# EAGLE schematic BubbleDisplayTempSensingThermistorNoSignalConditioning (EAGLE 7.6.0)
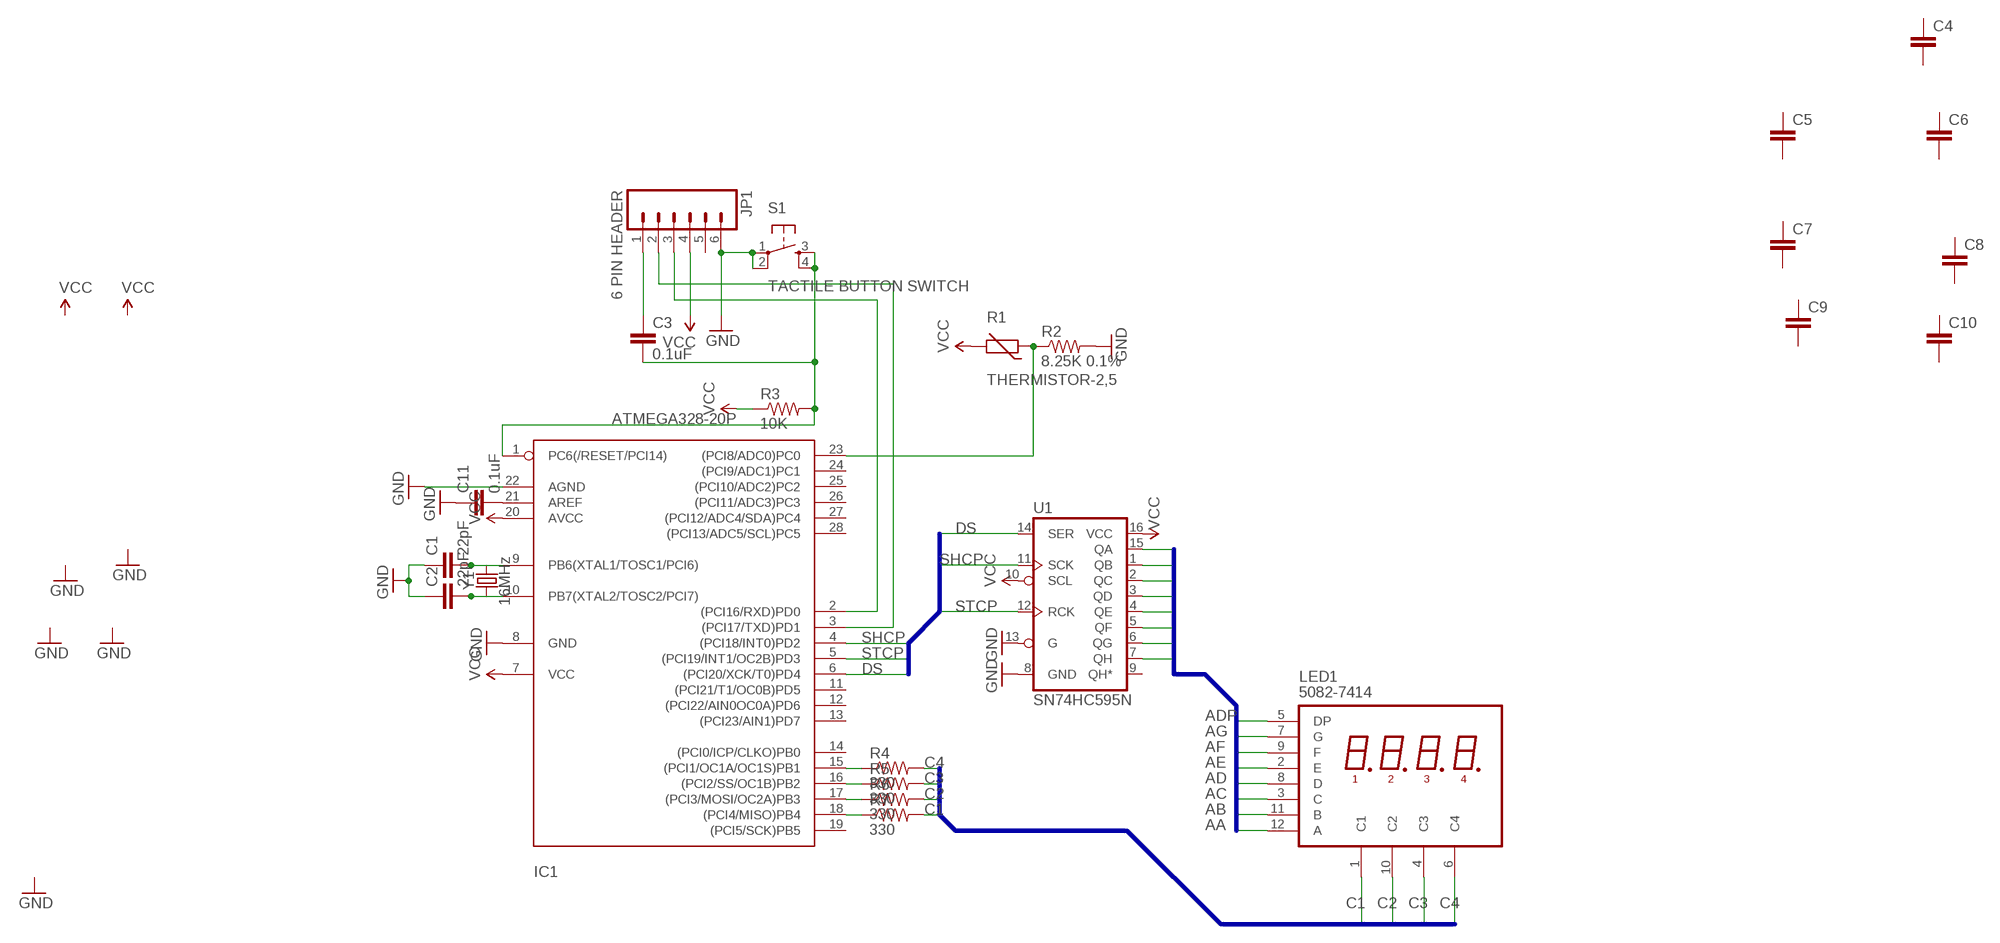
[diagram p0: schematic, sheet 1]

## Parts
C1  22pF  CAPKIT  [CAP-PTH-SMALL-KIT]
C2  22pF  CAPKIT  [CAP-PTH-SMALL-KIT]
C3  0.1uF  CAPEZ  [CAP-PTH-SMALLEZ]
C4  CAPEZ  [CAP-PTH-SMALLEZ]
C5  CAPEZ  [CAP-PTH-SMALLEZ]
C6  CAPEZ  [CAP-PTH-SMALLEZ]
C7  CAPEZ  [CAP-PTH-SMALLEZ]
C8  CAPEZ  [CAP-PTH-SMALLEZ]
C9  CAPEZ  [CAP-PTH-SMALLEZ]
C10  CAPEZ  [CAP-PTH-SMALLEZ]
C11  0.1uF  CAPEZ  [CAP-PTH-SMALLEZ]
IC1  ATMEGA328-20P  [DIL28-3]
JP1  6 PIN HEADER  M06LOCK_LONGPADS  [1X06_LOCK_LONGPADS]
LED1  5082-7414  [5082-7414]
R1  THERMISTOR-2,5  [RS-2,5]
R2  8.25K 0.1%  RESISTORPTH-1/2W  [AXIAL-0.5]
R3  10K  RESISTORPTH-1/2W  [AXIAL-0.5]
R4  330  RESISTORPTH-1/2W  [AXIAL-0.5]
R5  330  RESISTORPTH-1/2W  [AXIAL-0.5]
R6  330  RESISTORPTH-1/2W  [AXIAL-0.5]
R7  330  RESISTORPTH-1/2W  [AXIAL-0.5]
S1  TACTILE BUTTON SWITCH  TAC_SWITCHPTH  [TACTILE-PTH]
U1  SN74HC595N  74HC595N  [DIP16]
Y1  16MHz  CRYSTAL-16MHZPTH-HC49US  [HC49US]

## Nets
AA: LED1.12(A) U1.15(QA)
AB: LED1.11(B) U1.1(QB)
AC: LED1.3(C) U1.2(QC)
AD: LED1.8(D) U1.3(QD)
ADP: LED1.5(DP) U1.7(QH)
AE: LED1.2(E) U1.4(QE)
AF: LED1.9(F) U1.5(QF)
AG: LED1.7(G) U1.6(QG)
C1: LED1.1(C1) R7.P$2
C2: LED1.10(C2) R6.P$2
C3: LED1.4(C3) R5.P$2
C4: LED1.6(C4) R4.P$2
DS: IC1.6((PCI20/XCK/T0)PD4) U1.14(SER)
GND: C1.1 C2.1 C11.1 IC1.8(GND) IC1.22(AGND) JP1.6 R2.P$2 S1.1 S1.2 U1.8(GND) U1.13(G)
N$1: C3.1 JP1.1
N$2: IC1.15((PCI1/OC1A/OC1S)PB1) R4.P$1
N$3: C3.2 IC1.1(PC6(/RESET/PCI14)) R3.P$2 S1.3 S1.4
N$4: C11.2 IC1.21(AREF)
N$5: C1.2 IC1.9(PB6(XTAL1/TOSC1/PCI6)) Y1.2
N$6: C2.2 IC1.10(PB7(XTAL2/TOSC2/PCI7)) Y1.1
N$7: IC1.16((PCI2/SS/OC1B)PB2) R5.P$1
N$8: IC1.23((PCI8/ADC0)PC0) R1.1 R2.P$1
N$9: IC1.3((PCI17/TXD)PD1) JP1.2
N$10: IC1.2((PCI16/RXD)PD0) JP1.3
N$11: IC1.17((PCI3/MOSI/OC2A)PB3) R6.P$1
N$12: IC1.18((PCI4/MISO)PB4) R7.P$1
SHCP: IC1.4((PCI18/INT0)PD2) U1.11(SCK)
STCP: IC1.5((PCI19/INT1/OC2B)PD3) U1.12(RCK)
VCC: IC1.7(VCC) IC1.20(AVCC) JP1.4 R1.2 R3.P$1 U1.10(SCL) U1.16(VCC)
Unconnected: C4.1 C4.2 C5.1 C5.2 C6.1 C6.2 C7.1 C7.2 C8.1 C8.2 C9.1 C9.2 C10.1 C10.2 IC1.11((PCI21/T1/OC0B)PD5) IC1.12((PCI22/AIN0OC0A)PD6) IC1.13((PCI23/AIN1)PD7) IC1.14((PCI0/ICP/CLKO)PB0) IC1.19((PCI5/SCK)PB5) IC1.24((PCI9/ADC1)PC1) IC1.25((PCI10/ADC2)PC2) IC1.26((PCI11/ADC3)PC3) IC1.27((PCI12/ADC4/SDA)PC4) IC1.28((PCI13/ADC5/SCL)PC5) JP1.5 U1.9(QH*)

## Buses
C1,C2,C3,C4
SHCP,STCP,DS
AA,AB,AC,AD,AE,AF,AG,ADP

## Library data of the parts
C1-C11 = SparkFun-Capacitors:CAP: Capacitor Standard 0603 ceramic capacitor, and 0.1" leaded capacitor.
IC1 = atmega328:ATMEGA328*P: MICROCONTROLLER 32 kBytes FLASH 2 kBytes SRAM 1 kBytes EEPROM USART 8-channel 10 bit ADC
JP1 = SparkFun-Connectors:M06: Header 6 Standard 6-pin 0.1" header. Use with straight break away headers (SKU : PRT-00116), right angle break away headers (PRT-00553), swiss pins (PRT-00743), machine pins (PRT-00117), and female headers (PRT-00115). Molex polarized connector foot print use with SKU : PRT-08094 with associated crimp pins and housings. NOTES ON THE VARIANTS LOCK and LOCK_LONGPADS... This footprint was designed to help hold the alignment of a through-hole component (i.e. 6-pin header) while soldering it into place. You may notice that each hole has been shifted either up or down by 0.005 of an inch from it's more standard position (which is a perfectly straight line). This slight alteration caused the pins (the squares in the middle) to touch the edges of the holes. Because they are alternating, it causes a "brace" to hold the component in place. 0.005 has proven to be the perfect amount of "off-center" position when using our standard breakaway headers. Although looks a little odd when you look at the bare footprint, once you have a header in there, the alteration is very hard to notice. Also, if you push a header all the way into place, it is covered up entirely on the bottom side. This idea of altering the position of holes to aid alignment will be further integrated into the Sparkfun Library for other footprints. It can help hold any component with 3 or more connection pins.
LED1 = hp-displays:5082-7414: 4 digits X 7-segment + DP LED display
R1 = varistor:THERMISTOR: THERMISTOR
R2-R7 = SparkFun-Passives:RESISTOR: Resistor Basic schematic elements and footprints for 0603, 1206, and PTH resistors.
S1 = SparkFun-Retired:TAC_SWITCH: Momentary Switch Button commonly used for reset or general input. Spark Fun Electronics SKU : COM-00097 SMT- SWCH-08247
U1 = SparkFun-IC-Logic:74*595: 8-Bit Shift Register (Serial to Parallel) Datasheet <http://cdn.sparkfun.com/datasheets/BreakoutBoards/MM74HC595.pdf> SparkFun Products SparkFun Shift Register Breakout - 74HC595 <https://www.sparkfun.com/products/10680> (BOB-10680); PROD_ID: IC-13123
Y1 = SparkFun-Clocks:CRYSTAL-16MHZ: 16MHz Crystal Digikey Example <http://www.digikey.com/product-search/en?keywords=535-9122-1-ND> Frequency: 16MHz Frequency Stability: ±50ppm Frequency Tolerance: ±20ppm Load Capacitance: 18pF SparkFun Products: Pro Micro -5V/16MHz <https://www.sparkfun.com/products/12640> SparkFun Serial Enabled LCD Kit <https://www.sparkfun.com/products/10097>; PROD_ID: XTAL-08181; SF_ID: COM-00536